# Altium schematic sheet SH1 - POWER.SchDoc: Power
size B; CheckedBy: Lance Bantoto; DrawnBy: Kyle Hong; Engineer: Kyle Hong; Organization: UW Robotics; Address1: 200 University Avenue; Address2: Waterloo; Address3: Ontario; Address4: Canada N2L 3G6; Revision: 2; SheetNumber: 1; SheetTotal: 8
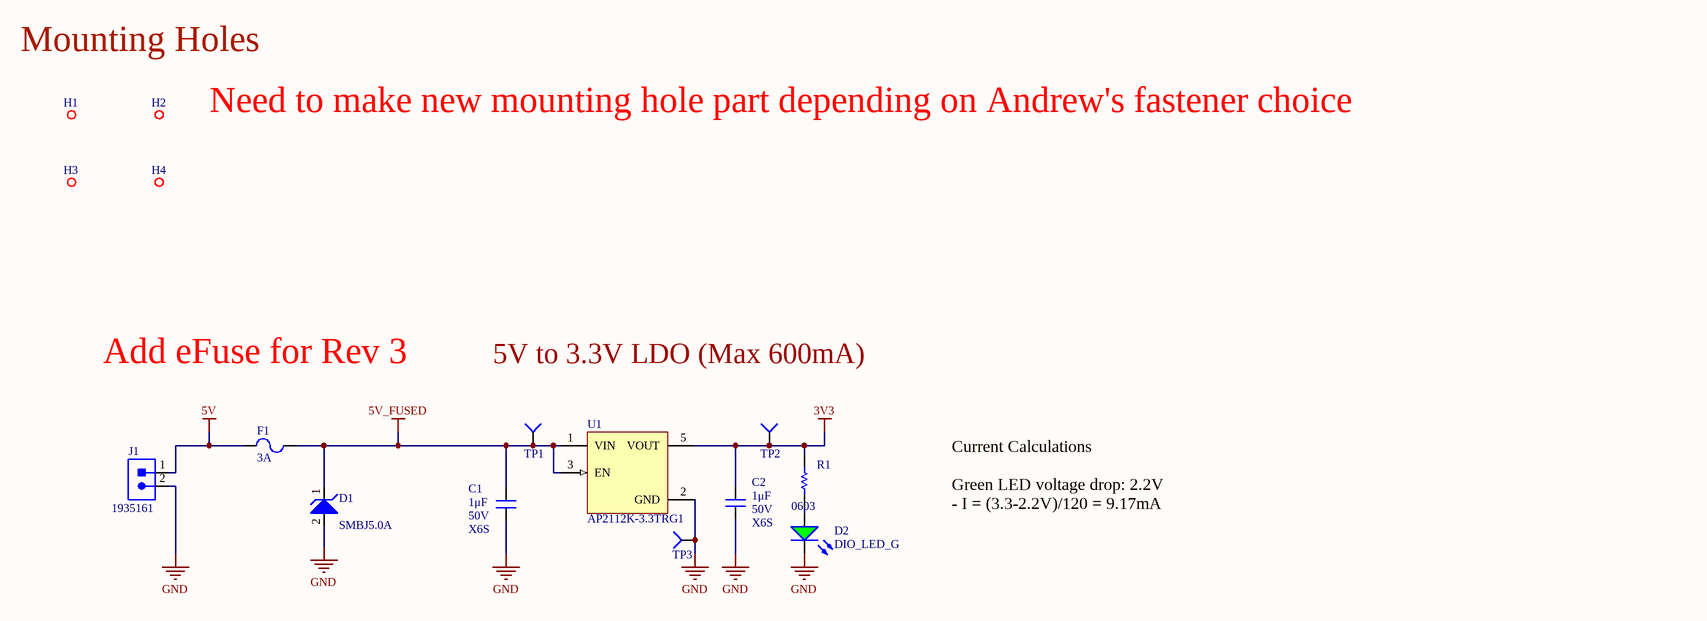
[diagram p0: SH1 - POWER.SchDoc]

## Parts
C1  value 1μF  Dielectric: X6S  Voltage Rating: 50V  [CAP0603]  (hidden comment: CAP_1uF_50V_0603)
C2  value 1μF  Dielectric: X6S  Voltage Rating: 50V  [CAP0603]  (hidden comment: CAP_1uF_50V_0603)
D1  TVS_DIODE_UNIDIR_5V  [SMBJ5.0A]  (value not drawn)
D2  DIO_LED_G  [LED_0805_GREEN]
F1  Current Rating: 3A  [FUSE_1206]  (hidden comment: FUSE_3A_1206)
H1  MOUNTING_HOLE_M3  [MOUNTING_HOLE_3mm]  (value not drawn)  (no BOM)
H2  MOUNTING_HOLE_M3  [MOUNTING_HOLE_3mm]  (value not drawn)  (no BOM)
H3  MOUNTING_HOLE_M3  [MOUNTING_HOLE_3mm]  (value not drawn)  (no BOM)
H4  MOUNTING_HOLE_M3  [MOUNTING_HOLE_3mm]  (value not drawn)  (no BOM)
J1  CON_2M_TERM  [1935161]  (value not drawn)
R1  Package/Footprint: 0603  [RESC0603]  (hidden comment: RES_120Ω_0603_5%_HP)
TP1  TESTPOINT_SMD_LOOP  [S1751-46R]  (value not drawn)
TP2  TESTPOINT_SMD_LOOP  [S1751-46R]  (value not drawn)
TP3  TESTPOINT_SMD_LOOP  [S1751-46R]  (value not drawn)
U1  Manufacturer Part Number 1: AP2112K-3.3TRG1  [SOT95P285X140-5N]  (hidden comment: LDO_3.3V_600mA)

## Nets
3V3: C2.2 R1.2 TP2.1(=value) U1.5(VOUT)
5V: F1.1 J1.1
5V_FUSED: C1.2 D1.1 F1.2 TP1.1(=value) U1.1(VIN) U1.3(EN)
GND: C1.1 C2.1 D1.2 D2.2(K) J1.2 TP3.1(=value) U1.2(GND)
NetD2_1: D2.1(A) R1.1

## Notes on the sheet
- Mounting Holes
- Need to make new mounting hole part depending on Andrew's fastener choice
- Add eFuse for Rev 3
- 5V to 3.3V LDO (Max 600mA)
- Current Calculations
  Green LED voltage drop: 2.2V
  - I = (3.3-2.2V)/120 = 9.17mA
- Title:
- Project:
- Date:
- Rev:
- Reviewer:
- Engineer:
- Sheet:
- of

## Library data of the parts
C1 C2 = CAP_1uF_50V_0603: CAP CER 1UF 50V X6S 0603; Manufacturer 1: TDK Corporation; Manufacturer Part Number 1: C1608X6S1H105K080AC; Supplier Part Number 1: 445-7424-1-ND; Supplier 1: Digi-Key
D1 = TVS_DIODE_UNIDIR_5V: TVS DIODE 5V 9.2V SMB; Manufacturer 1: Bourns; Supplier 1: Digi-Key; Supplier Part Number 1: SMBJ5.0ABCT-ND; Manufacturer Part Number 1: SMBJ5.0A; Mounting Type: SMD; Package/Footprint: SMB
D2 = DIO_LED_G: LED GREEN DIFFUSED 0805 SMD; Manufacturer Part Number 1: LG R971-KN-1; Manufacturer 1: OSRAM; Forward Voltage Drop: 2.2V; Package/Footprint: 0805; Supplier Part Number 1: 475-1410-1-ND; Supplier 1: Digi-Key; Mounting Type: SMD
F1 = FUSE_3A_1206: FUSE BOARD MNT 3A 32VAC/VDC 1206; Manufacturer 1: Littelfuse; Manufacturer Part Number 1: 0466003.NR; Package/Footprint: 1206; Supplier 1: Digi-Key; Supplier Part Number 1: F1458CT-ND; Mounting Type: SMD
J1 = CON_2M_TERM: TERM BLK 2POS SIDE ENTRY 5MM; Manufacturer 1: Phoenix Contact; Max Current Rating: 16A; Current: 18A; Voltage: 300V; Package/Footprint: SMD; Supplier 1: Digi-Key; Manufacturer Part Number 1: 1935161; Supplier Part Number 1: 277-1667-ND; Mounting Type: TH
R1 = RES_120Ω_0603_5%_HP: RES 120 OHM 5% 1/4W 0603; Manufacturer 1: Rohm; Manufacturer Part Number 1: ESR03EZPJ121; Supplier Part Number 1: RHM120DCT-ND; Supplier 1: Digi-Key; Mounting Type: SMD
TP1-TP3 = TESTPOINT_SMD_LOOP: TESTPOINT SMD; Manufacturer 1: Harwin; Supplier 1: Digi-Key; Manufacturer Part Number 1: S1751-46R; Supplier Part Number 1: 952-1478-1-ND; Mounting Type: SMD; Package/Footprint: SMD
U1 = LDO_3.3V_600mA: IC REG LINEAR 3.3V 600MA SOT25; Manufacturer 1: Diodes Incorporated; Input Voltage (Max): 6V; Voltage Dropout (Max): 0.4V; Package/Footprint: SOT-25; Supplier 1: Digi-Key; Supplier Part Number 1: AP2112K-3.3TRG1DICT-ND; Output Voltage (Fixed): 3.3V; Output Current: 600mA; Operating Temperature: -40°C - 85°C; LCSC Part #: C51118; Mounting Type: SMD